# Altium schematic sheet Schematic_relay.SchDoc
size A; SheetNumber: 1; SheetTotal: 1
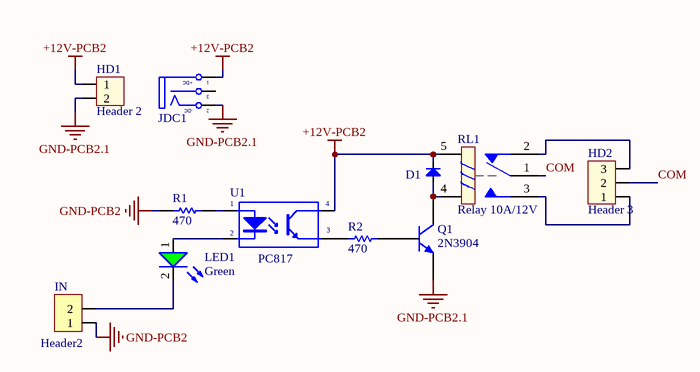
[diagram p0: Schematic_relay.SchDoc]

## Parts
D1  Diode  [DIO-1A-SMALL]  (value not drawn)
HD1  Header 2  [HED2]
HD2  Header 3  [HED3B]
IN  Header2  [HDR2]
JDC1  Jack DC  [DC-IN]  (value not drawn)
LED1  value Green  [LED3G]  (hidden comment: LED_G_3)
Q1  2N3904  [TO-92A]
R1  value 470  [RES 1/2W]  (hidden comment: RESISTOR)
R2  value 470  [RES 1/2W]  (hidden comment: RESISTOR)
RL1  Relay 10A/12V  [RELAY 5]
U1  PC817  [DIP4]

## Nets
+12V-PCB2: D1.2(K) HD1.1 JDC1.1(T) RL1.5 U1.4(C)
GND-PCB2: IN.1 R1.1
GND-PCB2.1: HD1.2 JDC1.2(TN) Q1.1(E)
COM: HD2.2 RL1.1
NetD1_1: D1.1(A) Q1.3(C) RL1.4
NetHD2_1: HD2.1 RL1.3
NetHD2_3: HD2.3 RL1.2
NetIN_2: IN.2 LED1.2(K)
NetLED1_1: LED1.1(A) U1.2(K)
NetQ1_2: Q1.2(B) R2.2
NetR1_2: R1.2 U1.1(A)
NetR2_1: R2.1 U1.3(E)

Not connected (* = marked no-connect by the designer): JDC1 3(S)

## Notes on the sheet
- (in symbol Jack DC) +DC; -DC

## Library data of the parts
D1 = Diode: Default Diode; Code - JEDEC: DO-214-AB; Value: 1N5007; Published: 8-Jun-2000; Revision: July-2002: Re-released for DXP Platform.; Publisher: Altium Limited
HD1 = Hed2: Header 2 (Green); Value: Header 2
HD2 = Hed3: Header 3 (Green); Value: Header 3
IN = Header2: Header IDC, 2 x 1 Pin Vertical 2.54mm Pitch (Non-Boxed, Male); Manufacturer: W¨¹rth Elektronik eiSos GmbH; partNo: 613002143121; ComponentLink1 Description: Manufacturer; ComponentLink2 Description: Datasheet; NoPins: 02; Created Date: 29 March 2013; ComponentLink1URL: http://www.we-online.com; ComponentLink2URL: http://katalog.we-online.de/em/datasheet/6130xx143121.pdf; Created by: Karrer Zheng
JDC1 = Jack DC: Jack DC input; Value: Jac DC
LED1 = LED_GREEN_3MM: LED Green 3mm; ComponentLink1Description: Datasheet; ComponentLink1URL: D:\Dropbox\Datasheets\Opto and Illumination\LEDs\SMD LED.pdf; Unit Price: 0.0476
Q1 = 2N3904: NPN General Purpose Amplifier; Published: 8-Jun-2000; LatestRevisionDate: 15-Jan-2003; LatestRevisionNote: PCB Footprint 'BCY-W3/D4.7' replaced; DatasheetVersion: 1997; PackageVersion: Sep-1998; PackageReference: TO-92A; Publisher: Altium Limited; PackageDescription: TO, Flat Index; 3 In-Line, Axial Leads; Body Dia. 4.5mm; Leads 0.51 x 0.48 mm (max); ComponentLink1Description: Manufacturer Link; ComponentLink1URL: http://www.fairchildsemi.com/; ComponentLink2Description: Datasheet; ComponentLink2URL: http://www.fairchildsemi.com/ds/2N%2F2N3904.pdf
RL1 = Relay 5: Relay SPDT,10A - 12VDC 5 Pin; Value: Relay SPDT, 10A, 12V
U1 = PC817: Single Opto; Value: PC817